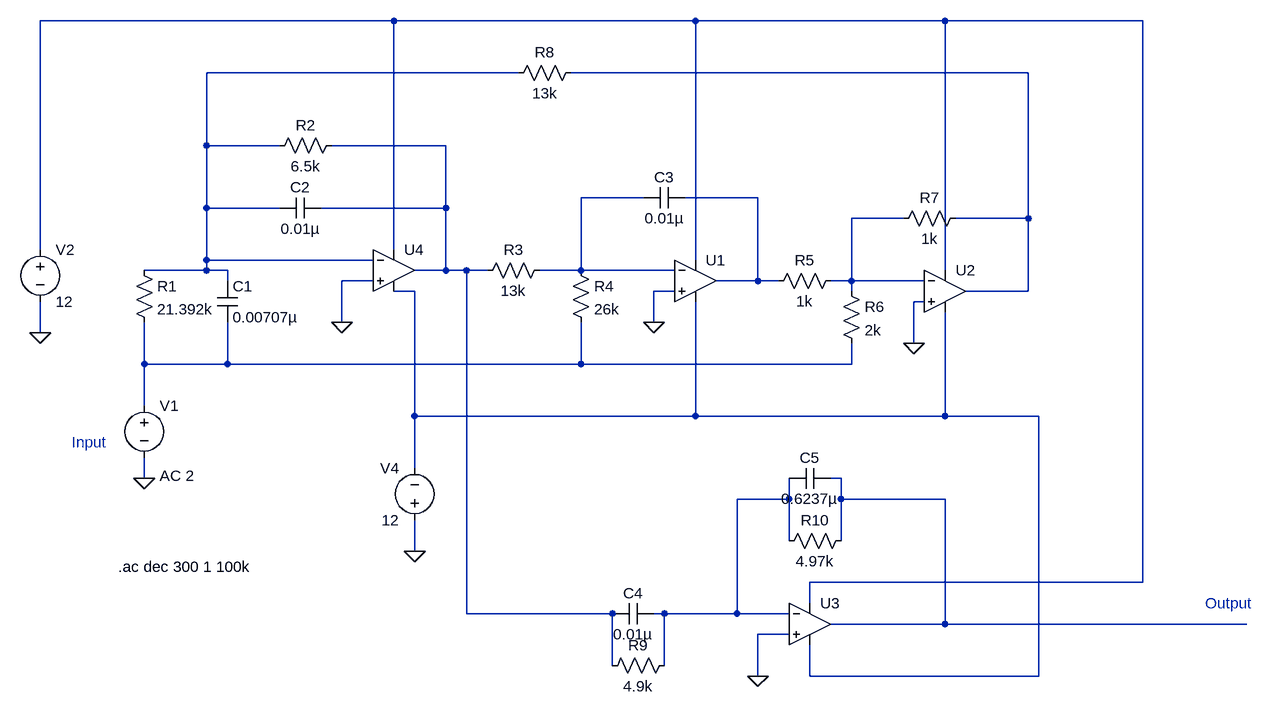
[diagram p0: schematic 18D070050_Group15.asc]
18D070050_Group15.asc, the LTspice schematic file:
Version 4
SHEET 1 1668 704
WIRE 336 -336 -208 -336
WIRE 800 -336 336 -336
WIRE 1184 -336 800 -336
WIRE 1488 -336 1184 -336
WIRE 528 -256 48 -256
WIRE 1312 -256 608 -256
WIRE 48 -144 48 -256
WIRE 160 -144 48 -144
WIRE 416 -144 240 -144
WIRE 720 -64 624 -64
WIRE 896 -64 784 -64
WIRE 48 -48 48 -144
WIRE 160 -48 48 -48
WIRE 416 -48 416 -144
WIRE 416 -48 224 -48
WIRE 1120 -32 1040 -32
WIRE 1312 -32 1312 -256
WIRE 1312 -32 1200 -32
WIRE -208 16 -208 -336
WIRE 336 16 336 -336
WIRE 48 32 48 -48
WIRE 304 32 48 32
WIRE 800 32 800 -336
WIRE 48 48 48 32
WIRE 48 48 -48 48
WIRE 80 48 48 48
WIRE 416 48 416 -48
WIRE 416 48 368 48
WIRE 448 48 416 48
WIRE 480 48 448 48
WIRE 624 48 624 -64
WIRE 624 48 560 48
WIRE 768 48 624 48
WIRE 1184 48 1184 -336
WIRE 80 64 80 48
WIRE 304 64 256 64
WIRE 896 64 896 -64
WIRE 896 64 832 64
WIRE 928 64 896 64
WIRE 1040 64 1040 -32
WIRE 1040 64 1008 64
WIRE 1152 64 1040 64
WIRE 368 80 336 80
WIRE 768 80 736 80
WIRE 1040 80 1040 64
WIRE 1312 80 1312 -32
WIRE 1312 80 1216 80
WIRE 1152 96 1136 96
WIRE 256 128 256 64
WIRE 736 128 736 80
WIRE -208 144 -208 96
WIRE 1136 160 1136 96
WIRE -48 192 -48 128
WIRE 80 192 80 128
WIRE 80 192 -48 192
WIRE 624 192 624 128
WIRE 624 192 80 192
WIRE 1040 192 1040 160
WIRE 1040 192 624 192
WIRE -48 256 -48 192
WIRE 368 272 368 80
WIRE 800 272 800 96
WIRE 800 272 368 272
WIRE 1184 272 1184 112
WIRE 1184 272 800 272
WIRE 1328 272 1184 272
WIRE 368 352 368 272
WIRE -48 368 -48 336
WIRE 1024 368 1008 368
WIRE 944 400 944 368
WIRE 944 400 864 400
WIRE 1024 400 1024 368
WIRE 1184 400 1024 400
WIRE 944 464 944 400
WIRE 1024 464 1024 400
WIRE 368 480 368 432
WIRE 1488 528 1488 -336
WIRE 1488 528 976 528
WIRE 976 560 976 528
WIRE 448 576 448 48
WIRE 672 576 448 576
WIRE 752 576 736 576
WIRE 864 576 864 400
WIRE 864 576 752 576
WIRE 944 576 864 576
WIRE 1184 592 1184 400
WIRE 1184 592 1008 592
WIRE 1648 592 1184 592
WIRE 944 608 896 608
WIRE 672 656 672 576
WIRE 752 656 752 576
WIRE 896 672 896 608
WIRE 976 672 976 624
WIRE 1328 672 1328 272
WIRE 1328 672 976 672
FLAG 256 128 0
FLAG 736 128 0
FLAG 1136 160 0
FLAG -48 368 0
FLAG -208 144 0
FLAG 368 480 0
FLAG 896 672 0
SYMBOL res -64 32 R0
SYMATTR InstName R1
SYMATTR Value 21.392k
SYMBOL cap 64 64 R0
SYMATTR InstName C1
SYMATTR Value 0.00707µ
SYMBOL res 256 -160 R90
WINDOW 0 0 56 VBottom 2
WINDOW 3 32 56 VTop 2
SYMATTR InstName R2
SYMATTR Value 6.5k
SYMBOL cap 224 -64 R90
WINDOW 0 0 32 VBottom 2
WINDOW 3 32 32 VTop 2
SYMATTR InstName C2
SYMATTR Value 0.01µ
SYMBOL res 576 32 R90
WINDOW 0 0 56 VBottom 2
WINDOW 3 32 56 VTop 2
SYMATTR InstName R3
SYMATTR Value 13k
SYMBOL res 608 32 R0
SYMATTR InstName R4
SYMATTR Value 26k
SYMBOL cap 784 -80 R90
WINDOW 0 0 32 VBottom 2
WINDOW 3 32 32 VTop 2
SYMATTR InstName C3
SYMATTR Value 0.01µ
SYMBOL res 1024 48 R90
WINDOW 0 0 56 VBottom 2
WINDOW 3 32 56 VTop 2
SYMATTR InstName R5
SYMATTR Value 1k
SYMBOL res 1024 64 R0
SYMATTR InstName R6
SYMATTR Value 2k
SYMBOL res 1216 -48 R90
WINDOW 0 0 56 VBottom 2
WINDOW 3 32 56 VTop 2
SYMATTR InstName R7
SYMATTR Value 1k
SYMBOL res 624 -272 R90
WINDOW 0 0 56 VBottom 2
WINDOW 3 32 56 VTop 2
SYMATTR InstName R8
SYMATTR Value 13k
SYMBOL voltage -48 240 R0
WINDOW 123 24 124 Left 2
WINDOW 39 0 0 Left 0
SYMATTR Value2 AC 2
SYMATTR InstName V1
SYMATTR Value ""
SYMBOL OpAmps\\UniversalOpamp2 336 48 R0
SYMATTR InstName U4
SYMBOL OpAmps\\UniversalOpamp2 800 64 R0
SYMATTR InstName U1
SYMBOL OpAmps\\UniversalOpamp2 1184 80 R0
SYMATTR InstName U2
SYMBOL voltage -208 0 R0
WINDOW 123 0 0 Left 0
WINDOW 39 0 0 Left 0
SYMATTR InstName V2
SYMATTR Value 12
SYMBOL voltage 368 448 R180
WINDOW 0 24 96 Left 2
WINDOW 3 24 16 Left 2
WINDOW 123 0 0 Left 0
WINDOW 39 0 0 Left 0
SYMATTR InstName V4
SYMATTR Value 12
SYMBOL OpAmps\\UniversalOpamp2 976 592 R0
SYMATTR InstName U3
SYMBOL res 768 640 R90
WINDOW 0 0 56 VBottom 2
WINDOW 3 32 56 VTop 2
SYMATTR InstName R9
SYMATTR Value 4.9k
SYMBOL res 1040 448 R90
WINDOW 0 0 56 VBottom 2
WINDOW 3 32 56 VTop 2
SYMATTR InstName R10
SYMATTR Value 4.97k
SYMBOL cap 736 560 R90
WINDOW 0 0 32 VBottom 2
WINDOW 3 32 32 VTop 2
SYMATTR InstName C4
SYMATTR Value 0.01µ
SYMBOL cap 1008 352 R90
WINDOW 0 0 32 VBottom 2
WINDOW 3 32 32 VTop 2
SYMATTR InstName C5
SYMATTR Value 0.6237µ
TEXT 1584 560 Left 2 ;Output
TEXT -160 312 Left 2 ;Input
TEXT -88 504 Left 2 !.ac dec 300 1 100k

The netlist it stands for:
* 18D070050_Group15.asc
R1 N002 N009 21.392k
C1 N002 N009 0.00707µ
R2 N004 N002 6.5k
C2 N004 N002 0.01µ
R3 N005 N004 13k
R4 N005 N009 26k
C3 N006 N005 0.01µ
R5 N007 N006 1k
R6 N007 N009 2k
R7 N003 N007 1k
R8 N003 N002 13k
V1 N009 0 AC 2
XU4 0 N002 N001 N008 N004 level.2 Avol=1Meg GBW=10Meg Slew=10Meg ilimit=25m rail=0 Vos=0 phimargin=45 en=0 enk=0 in=0 ink=0 Rin=500Meg  ; pins IN+ IN- V+ V- OUT
XU1 0 N005 N001 N008 N006 level.2 Avol=1Meg GBW=10Meg Slew=10Meg ilimit=25m rail=0 Vos=0 phimargin=45 en=0 enk=0 in=0 ink=0 Rin=500Meg  ; pins IN+ IN- V+ V- OUT
XU2 0 N007 N001 N008 N003 level.2 Avol=1Meg GBW=10Meg Slew=10Meg ilimit=25m rail=0 Vos=0 phimargin=45 en=0 enk=0 in=0 ink=0 Rin=500Meg  ; pins IN+ IN- V+ V- OUT
V2 N001 0 12
V4 0 N008 12
XU3 0 N011 N001 N008 N010 level.2 Avol=1Meg GBW=10Meg Slew=10Meg ilimit=25m rail=0 Vos=0 phimargin=45 en=0 enk=0 in=0 ink=0 Rin=500Meg  ; pins IN+ IN- V+ V- OUT
R9 N011 N004 4.9k
R10 N010 N011 4.97k
C4 N011 N004 0.01µ
C5 N010 N011 0.6237µ
* Output
* Input
.ac dec 300 1 100k
.lib UniversalOpamps2.sub
.backanno
.end